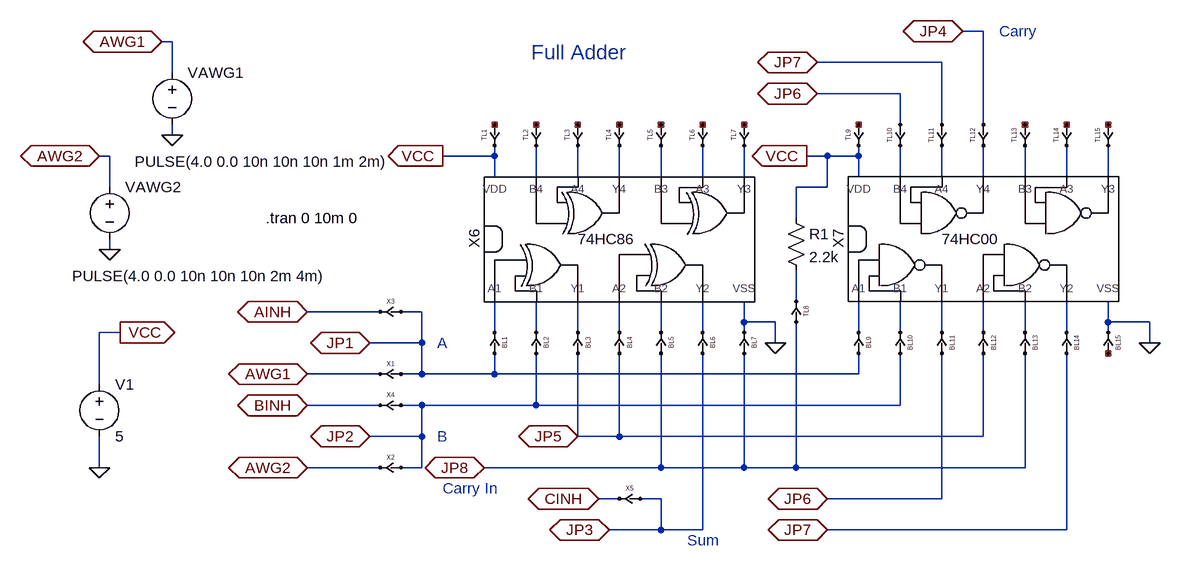
[diagram p0: schematic full-adder-test.asc]
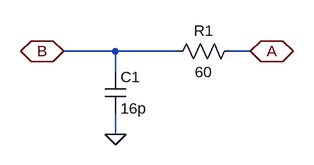
[diagram p1: sub-circuit cross_point.asc]
full-adder-test.asc, the LTspice schematic file:
Version 4
SHEET 1 1560 712
WIRE 816 -160 784 -160
WIRE -432 -144 -448 -144
WIRE 752 -112 560 -112
WIRE -432 -96 -432 -144
WIRE 688 -64 560 -64
WIRE 688 -16 688 -64
WIRE 752 -16 752 -112
WIRE 816 -16 816 -160
WIRE -432 0 -432 -16
WIRE -528 32 -544 32
WIRE 64 32 64 16
WIRE 64 32 -16 32
WIRE 576 32 544 32
WIRE 624 32 624 16
WIRE 624 32 576 32
WIRE 64 64 64 32
WIRE 128 64 128 16
WIRE 192 64 192 16
WIRE 256 64 256 16
WIRE 320 64 320 16
WIRE 384 64 384 16
WIRE 448 64 448 16
WIRE 624 64 624 32
WIRE 688 64 688 16
WIRE 752 64 752 16
WIRE 816 64 816 16
WIRE 880 64 880 16
WIRE 944 64 944 16
WIRE 1008 64 1008 16
WIRE -528 80 -528 32
WIRE 576 80 576 32
WIRE 576 80 528 80
WIRE 528 128 528 80
WIRE -528 176 -528 160
WIRE 528 256 528 208
WIRE -112 272 -224 272
WIRE -48 272 -80 272
WIRE 448 288 448 256
WIRE 496 288 448 288
WIRE 1008 288 1008 256
WIRE 1072 288 1008 288
WIRE -512 304 -544 304
WIRE 64 304 64 256
WIRE 128 304 128 256
WIRE 192 304 192 256
WIRE 256 304 256 256
WIRE 320 304 320 256
WIRE 384 304 384 256
WIRE 448 304 448 288
WIRE 624 304 624 256
WIRE 688 304 688 256
WIRE 752 304 752 256
WIRE 816 304 816 256
WIRE 880 304 880 256
WIRE 944 304 944 256
WIRE 1008 304 1008 288
WIRE -48 320 -48 272
WIRE -48 320 -128 320
WIRE 496 320 496 288
WIRE 1072 320 1072 288
WIRE -112 368 -224 368
WIRE -48 368 -48 320
WIRE -48 368 -80 368
WIRE 64 368 64 336
WIRE 64 368 -48 368
WIRE 624 368 624 336
WIRE 624 368 64 368
WIRE -544 384 -544 304
WIRE -112 416 -224 416
WIRE -48 416 -80 416
WIRE 128 416 128 336
WIRE 128 416 -48 416
WIRE 688 416 688 336
WIRE 688 416 128 416
WIRE -48 464 -48 416
WIRE -48 464 -128 464
WIRE 192 464 192 336
WIRE 256 464 256 336
WIRE 256 464 192 464
WIRE 816 464 816 336
WIRE 816 464 256 464
WIRE -544 512 -544 464
WIRE -112 512 -224 512
WIRE -48 512 -48 464
WIRE -48 512 -80 512
WIRE 320 512 320 336
WIRE 320 512 48 512
WIRE 448 512 448 336
WIRE 448 512 320 512
WIRE 528 512 528 288
WIRE 528 512 448 512
WIRE 880 512 880 336
WIRE 880 512 528 512
WIRE 256 560 224 560
WIRE 320 560 288 560
WIRE 752 560 752 336
WIRE 752 560 576 560
WIRE 320 608 320 560
WIRE 320 608 240 608
WIRE 384 608 384 336
WIRE 384 608 320 608
WIRE 944 608 944 336
WIRE 944 608 576 608
FLAG -224 368 AWG1
IOPIN -224 368 BiDir
FLAG -224 512 AWG2
IOPIN -224 512 BiDir
FLAG -16 32 VCC
IOPIN -16 32 Out
FLAG 496 320 0
FLAG -128 320 JP1
IOPIN -128 320 BiDir
FLAG -128 464 JP2
IOPIN -128 464 BiDir
FLAG 784 -160 JP4
IOPIN 784 -160 BiDir
FLAG -224 272 AINH
IOPIN -224 272 BiDir
FLAG -224 416 BINH
IOPIN -224 416 BiDir
FLAG 240 608 JP3
IOPIN 240 608 BiDir
FLAG 224 560 CINH
IOPIN 224 560 BiDir
FLAG 48 512 JP8
IOPIN 48 512 BiDir
FLAG 576 560 JP6
IOPIN 576 560 BiDir
FLAG 560 -64 JP6
IOPIN 560 -64 BiDir
FLAG 192 464 JP5
IOPIN 192 464 BiDir
FLAG 576 608 JP7
IOPIN 576 608 BiDir
FLAG 560 -112 JP7
IOPIN 560 -112 BiDir
FLAG -432 0 0
FLAG -448 -144 AWG1
IOPIN -448 -144 BiDir
FLAG -528 176 0
FLAG -544 32 AWG2
IOPIN -544 32 BiDir
FLAG 544 32 VCC
IOPIN 544 32 Out
FLAG 1072 320 0
FLAG -512 304 VCC
IOPIN -512 304 Out
FLAG -544 512 0
SYMBOL cross_point 64 320 R90
SYMATTR InstName BL1
SYMBOL cross_point 64 0 R270
SYMATTR InstName TL1
SYMBOL cross_point -96 368 R0
SYMATTR InstName X1
SYMBOL cross_point -96 512 R0
SYMATTR InstName X2
SYMBOL cross_point -96 272 R0
SYMATTR InstName X3
SYMBOL cross_point -96 416 R0
SYMATTR InstName X4
SYMBOL cross_point 272 560 R0
SYMATTR InstName X5
SYMBOL voltage -432 -112 R0
WINDOW 123 0 0 Left 0
WINDOW 39 0 0 Left 0
WINDOW 3 -58 153 Left 2
SYMATTR Value PULSE(4.0 0.0 10n 10n 10n 1m 2m)
SYMATTR InstName VAWG1
SYMBOL voltage -528 64 R0
WINDOW 123 0 0 Left 0
WINDOW 39 0 0 Left 0
WINDOW 3 -58 153 Left 2
SYMATTR Value PULSE(4.0 0.0 10n 10n 10n 2m 4m)
SYMATTR InstName VAWG2
SYMBOL 74hc86 272 160 R0
SYMATTR InstName X6
SYMBOL cross_point 192 0 R270
SYMATTR InstName TL3
SYMBOL cross_point 128 0 R270
SYMATTR InstName TL2
SYMBOL cross_point 256 0 R270
SYMATTR InstName TL4
SYMBOL cross_point 320 0 R270
SYMATTR InstName TL5
SYMBOL cross_point 384 0 R270
SYMATTR InstName TL6
SYMBOL cross_point 448 0 R270
SYMATTR InstName TL7
SYMBOL cross_point 128 320 R90
SYMATTR InstName BL2
SYMBOL cross_point 192 320 R90
SYMATTR InstName BL3
SYMBOL cross_point 256 320 R90
SYMATTR InstName BL4
SYMBOL cross_point 320 320 R90
SYMATTR InstName BL5
SYMBOL cross_point 384 320 R90
SYMATTR InstName BL6
SYMBOL cross_point 448 320 R90
SYMATTR InstName BL7
SYMBOL 74hc00 832 160 R0
SYMATTR InstName X7
SYMBOL cross_point 1008 0 R270
SYMATTR InstName TL15
SYMBOL cross_point 624 0 R270
SYMATTR InstName TL9
SYMBOL cross_point 688 0 R270
SYMATTR InstName TL10
SYMBOL cross_point 752 0 R270
SYMATTR InstName TL11
SYMBOL cross_point 816 0 R270
SYMATTR InstName TL12
SYMBOL cross_point 880 0 R270
SYMATTR InstName TL13
SYMBOL cross_point 944 0 R270
SYMATTR InstName TL14
SYMBOL cross_point 1008 320 R90
SYMATTR InstName BL15
SYMBOL cross_point 624 320 R90
SYMATTR InstName BL9
SYMBOL cross_point 688 320 R90
SYMATTR InstName BL10
SYMBOL cross_point 752 320 R90
SYMATTR InstName BL11
SYMBOL cross_point 816 320 R90
SYMATTR InstName BL12
SYMBOL cross_point 880 320 R90
SYMATTR InstName BL13
SYMBOL cross_point 944 320 R90
SYMATTR InstName BL14
SYMBOL res 512 112 R0
SYMATTR InstName R1
SYMATTR Value 2.2k
SYMBOL voltage -544 368 R0
SYMATTR InstName V1
SYMATTR Value 5
SYMBOL cross_point 528 272 R90
SYMATTR InstName TL8
TEXT -288 128 Left 2 !.tran 0 10m 0
TEXT 360 624 Left 2 ;Sum
TEXT 840 -160 Left 2 ;Carry
TEXT -16 544 Left 2 ;Carry In
TEXT -24 320 Left 2 ;A
TEXT -24 464 Left 2 ;B
TEXT 120 -128 Left 3 ;Full Adder

cross_point.asc, the sub-circuit schematic file:
Version 4
SHEET 1 880 680
WIRE 80 160 0 160
WIRE 176 160 80 160
WIRE 288 160 256 160
WIRE 80 192 80 160
WIRE 80 288 80 256
FLAG 288 160 A
IOPIN 288 160 BiDir
FLAG 0 160 B
IOPIN 0 160 BiDir
FLAG 80 288 0
SYMBOL res 272 144 R90
WINDOW 0 0 56 VBottom 2
WINDOW 3 32 56 VTop 2
SYMATTR InstName R1
SYMATTR Value 60
SYMBOL cap 64 192 R0
SYMATTR InstName C1
SYMATTR Value 16p

The netlist it stands for:
* full-adder-test.asc
XBL1 JP1 N014 cross_point
XTL1 NC_01 VCC cross_point
XX1 JP1 AWG1 cross_point
XX2 JP2 AWG2 cross_point
XX3 JP1 AINH cross_point
XX4 JP2 BINH cross_point
XX5 JP3 CINH cross_point
VAWG1 AWG1 0 PULSE(4.0 0.0 10n 10n 10n 1m 2m)
VAWG2 AWG2 0 PULSE(4.0 0.0 10n 10n 10n 2m 4m)
XX6 N014 N015 N016 N017 N018 N019 0 N006 N005 N004 N003 N002 N001 VCC 74HC86  ; pins A1 B1 Y1 A2 B2 Y2 VSS Y3 A3 B3 Y4 A4 B4 VDD
XTL3 NC_02 N002 cross_point
XTL2 NC_03 N001 cross_point
XTL4 NC_04 N003 cross_point
XTL5 NC_05 N004 cross_point
XTL6 NC_06 N005 cross_point
XTL7 NC_07 N006 cross_point
XBL2 JP2 N015 cross_point
XBL3 JP5 N016 cross_point
XBL4 JP5 N017 cross_point
XBL5 JP8 N018 cross_point
XBL6 JP3 N019 cross_point
XBL7 JP8 0 cross_point
XX7 N020 N021 N022 N023 N024 N025 0 N012 N011 N010 N009 N008 N007 VCC 74HC00  ; pins A1 B1 Y1 A2 B2 Y2 VSS Y3 A3 B3 Y4 A4 B4 VDD
XTL15 NC_08 N012 cross_point
XTL9 NC_09 VCC cross_point
XTL10 JP6 N007 cross_point
XTL11 JP7 N008 cross_point
XTL12 JP4 N009 cross_point
XTL13 NC_10 N010 cross_point
XTL14 NC_11 N011 cross_point
XBL15 NC_12 0 cross_point
XBL9 JP1 N020 cross_point
XBL10 JP2 N021 cross_point
XBL11 JP6 N022 cross_point
XBL12 JP5 N023 cross_point
XBL13 JP8 N024 cross_point
XBL14 JP7 N025 cross_point
R1 VCC N013 2.2k
V1 VCC 0 5
XTL8 JP8 N013 cross_point

* block symbol definitions
.subckt cross_point A B
R1 A B 60
C1 B 0 16p
.ends cross_point

.tran 0 10m 0
* Sum
* Carry
* Carry In
* A
* B
* Full Adder
.backanno
.end